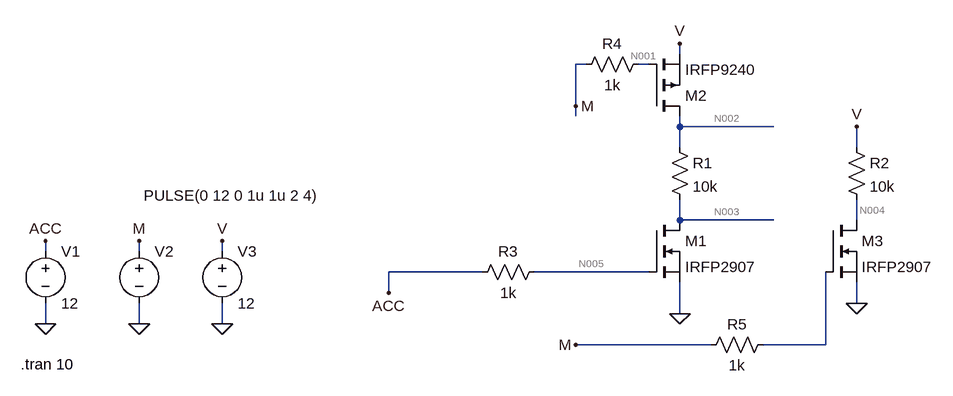
[diagram p0: schematic Draft3.asc]
Draft3.asc, the LTspice schematic file:
Version 4
SHEET 1 1520 692
WIRE 1088 -128 1088 -144
WIRE 944 -112 928 -112
WIRE 1040 -112 1024 -112
WIRE 928 -48 928 -112
WIRE 928 -32 928 -48
WIRE 1088 -16 1088 -32
WIRE 1232 -16 1088 -16
WIRE 1088 16 1088 -16
WIRE 1360 16 1360 -16
WIRE 1088 128 1088 96
WIRE 1232 128 1088 128
WIRE 1360 128 1360 96
WIRE 112 176 112 160
WIRE 256 176 256 160
WIRE 384 176 384 160
WIRE 784 208 640 208
WIRE 1040 208 864 208
WIRE 640 240 640 208
WIRE 1360 256 1360 224
WIRE 1088 272 1088 224
WIRE 112 288 112 256
WIRE 256 288 256 256
WIRE 384 288 384 256
WIRE 1136 320 928 320
WIRE 1312 320 1312 208
WIRE 1312 320 1216 320
FLAG 112 160 ACC
FLAG 112 288 0
FLAG 1088 272 0
FLAG 1088 -144 V
FLAG 256 160 M
FLAG 256 288 0
FLAG 384 160 V
FLAG 384 288 0
FLAG 928 -48 M
FLAG 1360 256 0
FLAG 1360 -16 V
FLAG 640 240 ACC
FLAG 928 320 M
SYMBOL nmos 1040 128 R0
SYMATTR InstName M1
SYMATTR Value IRFP2907
SYMBOL voltage 256 160 R0
WINDOW 3 7 -70 Left 2
WINDOW 123 0 0 Left 0
WINDOW 39 0 0 Left 0
SYMATTR InstName V2
SYMATTR Value PULSE(0 12 0 1u 1u 2 4)
SYMBOL voltage 384 160 R0
SYMATTR InstName V3
SYMATTR Value 12
SYMBOL res 1072 0 R0
SYMATTR InstName R1
SYMATTR Value 10k
SYMBOL pmos 1040 -32 M180
SYMATTR InstName M2
SYMATTR Value IRFP9240
SYMBOL nmos 1312 128 R0
SYMATTR InstName M3
SYMATTR Value IRFP2907
SYMBOL res 1344 0 R0
SYMATTR InstName R2
SYMATTR Value 10k
SYMBOL voltage 112 160 R0
SYMATTR InstName V1
SYMATTR Value 12
SYMBOL res 880 192 R90
WINDOW 0 0 56 VBottom 2
WINDOW 3 32 56 VTop 2
SYMATTR InstName R3
SYMATTR Value 1k
SYMBOL res 928 -96 R270
WINDOW 0 32 56 VTop 2
WINDOW 3 0 56 VBottom 2
SYMATTR InstName R4
SYMATTR Value 1k
SYMBOL res 1120 336 R270
WINDOW 0 32 56 VTop 2
WINDOW 3 0 56 VBottom 2
SYMATTR InstName R5
SYMATTR Value 1k
TEXT 74 350 Left 2 !.tran 10

The netlist it stands for:
* Draft3.asc
M1 N003 N005 0 0 IRFP2907
V2 M 0 PULSE(0 12 0 1u 1u 2 4)
V3 V 0 12
R1 N002 N003 10k
M2 N002 N001 V V IRFP9240
M3 N004 N006 0 0 IRFP2907
R2 V N004 10k
V1 ACC 0 12
R3 N005 ACC 1k
R4 M N001 1k
R5 M N006 1k
.model NMOS NMOS
.model PMOS PMOS
.lib standard.mos
.tran 10
.backanno
.end

* Results of the author's LTspice run, read from the files saved beside the schematic
* Operating Point, zero values left out:
*   V(n003) = 3.816 µV
*   V(n005) = 12 V
*   V(v) = 12 V
*   V(n002) = 12 V
*   V(n004) = 12 V
*   V(acc) = 12 V
*   Id(M2) = -1.2 mA
*   Is(M2) = 1.2 mA
*   Id(M3) = 815.2 pA
*   Is(M3) = -815.2 pA
*   Id(M1) = 1.2 mA
*   Is(M1) = -1.2 mA
*   I(R2) = 830.7 pA
*   I(R1) = 1.2 mA
*   I(V3) = -1.2 mA
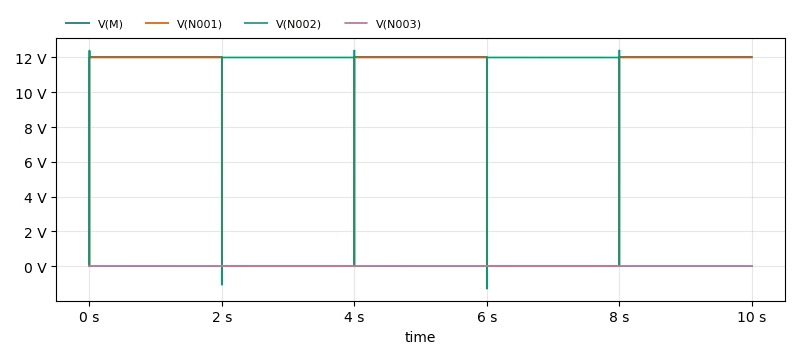
[diagram p1: Transient Analysis of Draft3.asc, plotted from the saved traces]
* Transient Analysis, 1 run:
*   V(M): min 0 V, max 12 V, average 7.2 V, rms 9.295 V, last 12 V
*   V(N001): min 0 V, max 12 V, average 7.2 V, rms 9.295 V, last 12 V
*   V(N002): min -1.3 V, max 12.41 V, average 4.8 V, rms 7.589 V, last 0 V
*   V(N003): min -413.5 nV, max 3.946 µV, average 1.526 µV, rms 2.413 µV, last 0 V